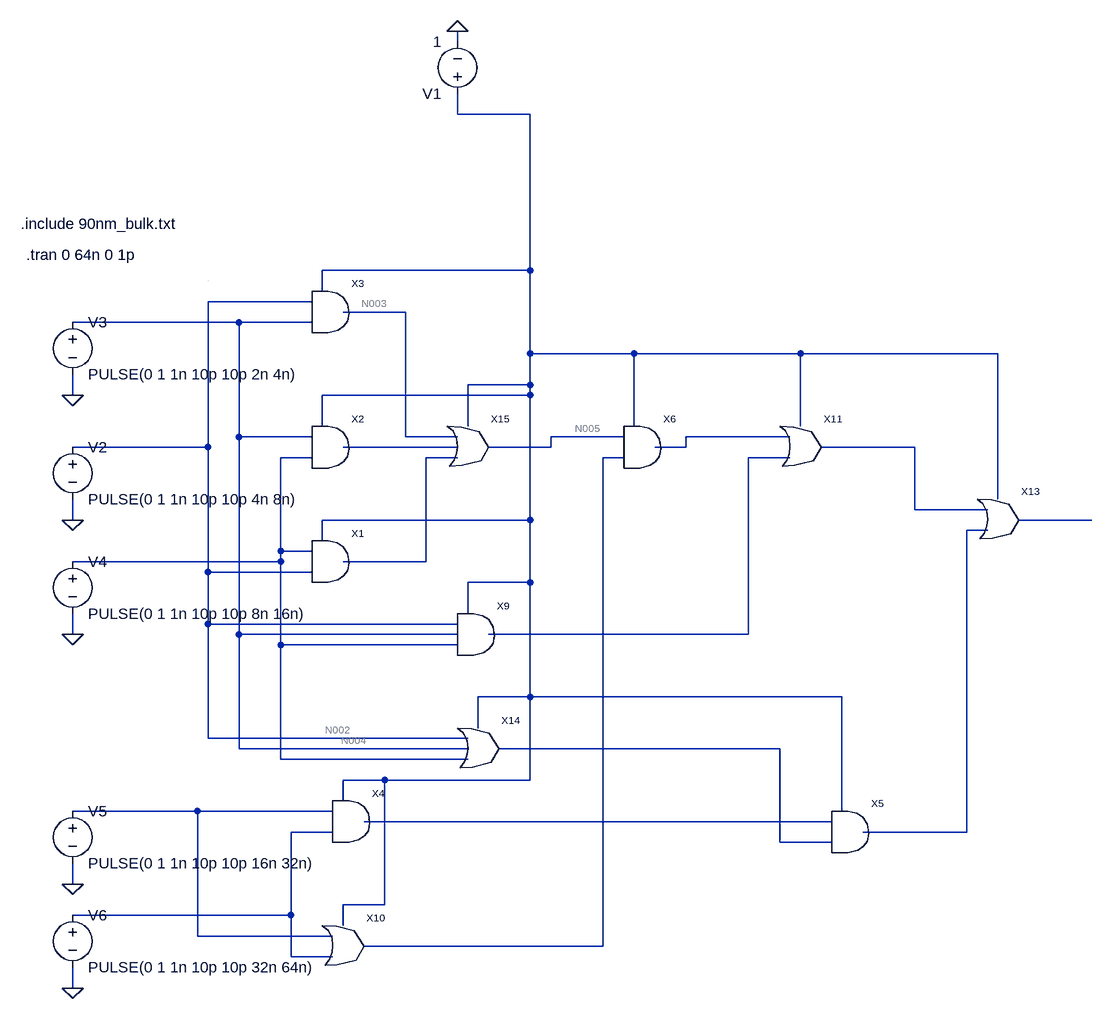
[diagram p0: schematic Major.asc]
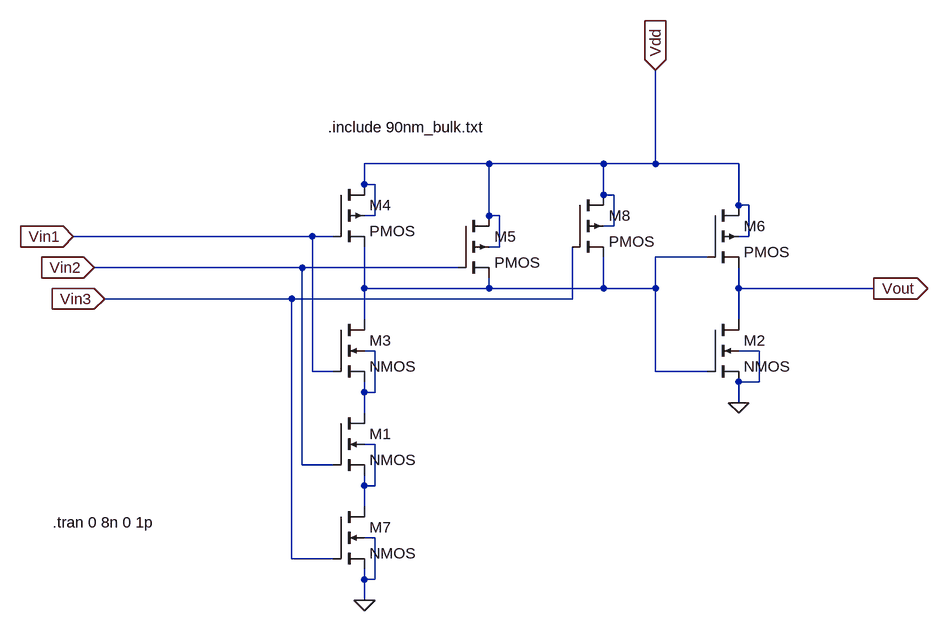
[diagram p1: sub-circuit and3.asc]
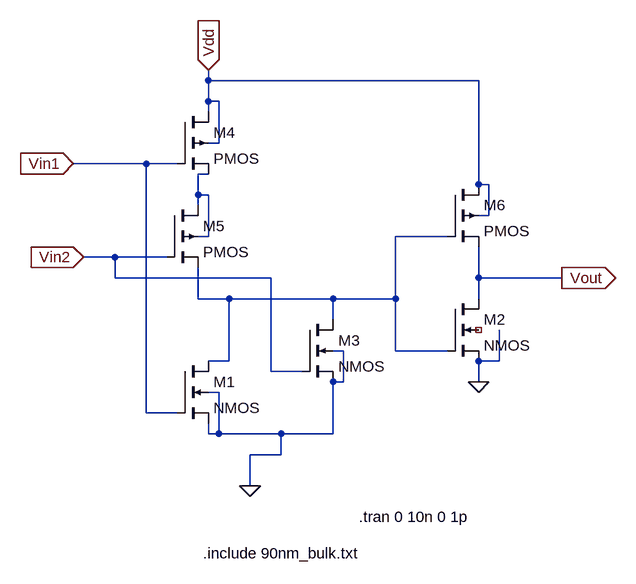
[diagram p2: sub-circuit or.asc]
Major.asc, the LTspice schematic file:
Version 4
SHEET 1 1664 1128
WIRE 384 -368 384 -384
WIRE 384 -256 384 -288
WIRE 496 -256 384 -256
WIRE 496 -16 496 -256
WIRE 496 -16 176 -16
WIRE 176 16 176 -16
WIRE 160 32 0 32
WIRE 304 48 208 48
WIRE 48 64 -208 64
WIRE 160 64 48 64
WIRE 496 112 496 -16
WIRE 656 112 496 112
WIRE 912 112 656 112
WIRE 1216 112 912 112
WIRE 496 160 496 112
WIRE 496 160 400 160
WIRE -208 176 -208 144
WIRE 496 176 496 160
WIRE 496 176 176 176
WIRE 176 224 176 176
WIRE 400 224 400 160
WIRE 656 224 656 112
WIRE 912 224 912 112
WIRE 48 240 48 64
WIRE 160 240 48 240
WIRE 304 240 304 48
WIRE 384 240 304 240
WIRE 640 240 528 240
WIRE 896 240 736 240
WIRE 0 256 0 32
WIRE 0 256 -208 256
WIRE 384 256 208 256
WIRE 528 256 528 240
WIRE 528 256 432 256
WIRE 736 256 736 240
WIRE 736 256 688 256
WIRE 1088 256 944 256
WIRE 160 272 112 272
WIRE 384 272 336 272
WIRE 640 272 608 272
WIRE 896 272 832 272
WIRE 1216 336 1216 112
WIRE 1088 352 1088 256
WIRE 1200 352 1088 352
WIRE -208 368 -208 336
WIRE 496 368 496 176
WIRE 496 368 176 368
WIRE 1360 368 1248 368
WIRE 1200 384 1168 384
WIRE 176 400 176 368
WIRE 112 416 112 272
WIRE 160 416 112 416
WIRE 112 432 112 416
WIRE 112 432 -208 432
WIRE 336 432 336 272
WIRE 336 432 208 432
WIRE 0 448 0 256
WIRE 160 448 0 448
WIRE 496 464 496 368
WIRE 496 464 400 464
WIRE 400 512 400 464
WIRE 0 528 0 448
WIRE 384 528 0 528
WIRE -208 544 -208 512
WIRE 48 544 48 240
WIRE 384 544 48 544
WIRE 832 544 832 272
WIRE 832 544 432 544
WIRE 112 560 112 432
WIRE 384 560 112 560
WIRE 496 640 496 464
WIRE 496 640 416 640
WIRE 976 640 496 640
WIRE 416 688 416 640
WIRE 0 704 0 528
WIRE 400 704 0 704
WIRE 48 720 48 544
WIRE 400 720 48 720
WIRE 880 720 448 720
WIRE 112 736 112 560
WIRE 400 736 112 736
WIRE 272 768 208 768
WIRE 496 768 496 640
WIRE 496 768 272 768
WIRE 208 800 208 768
WIRE -16 816 -208 816
WIRE 192 816 -16 816
WIRE 976 816 976 640
WIRE 960 832 240 832
WIRE 192 848 128 848
WIRE 1168 848 1168 384
WIRE 1168 848 1008 848
WIRE 880 864 880 720
WIRE 960 864 880 864
WIRE -208 928 -208 896
WIRE 272 960 272 768
WIRE 272 960 208 960
WIRE 128 976 128 848
WIRE 128 976 -208 976
WIRE 208 992 208 960
WIRE -16 1008 -16 816
WIRE 192 1008 -16 1008
WIRE 608 1024 608 272
WIRE 608 1024 240 1024
WIRE 128 1040 128 976
WIRE 192 1040 128 1040
WIRE -208 1088 -208 1056
WIRE 0 0 0 0
FLAG 384 -384 0
FLAG -208 176 0
FLAG -208 368 0
FLAG -208 544 0
FLAG -208 928 0
FLAG -208 1088 0
SYMBOL voltage 384 -272 R180
WINDOW 123 0 0 Left 2
WINDOW 39 0 0 Left 2
SYMATTR InstName V1
SYMATTR Value 1
SYMBOL voltage -208 240 R0
WINDOW 123 0 0 Left 2
WINDOW 39 0 0 Left 2
SYMATTR InstName V2
SYMATTR Value PULSE(0 1 1n 10p 10p 4n 8n)
SYMBOL voltage -208 48 R0
WINDOW 123 0 0 Left 2
WINDOW 39 0 0 Left 2
SYMATTR InstName V3
SYMATTR Value PULSE(0 1 1n 10p 10p 2n 4n)
SYMBOL voltage -208 416 R0
WINDOW 123 0 0 Left 2
WINDOW 39 0 0 Left 2
SYMATTR InstName V4
SYMATTR Value PULSE(0 1 1n 10p 10p 8n 16n)
SYMBOL voltage -208 800 R0
WINDOW 123 0 0 Left 2
WINDOW 39 0 0 Left 2
SYMATTR InstName V5
SYMATTR Value PULSE(0 1 1n 10p 10p 16n 32n)
SYMBOL voltage -208 960 R0
WINDOW 123 0 0 Left 2
WINDOW 39 0 0 Left 2
SYMATTR InstName V6
SYMATTR Value PULSE(0 1 1n 10p 10p 32n 64n)
SYMBOL and 192 432 R0
SYMATTR InstName X1
SYMBOL and 192 256 R0
SYMATTR InstName X2
SYMBOL and 192 48 R0
SYMATTR InstName X3
SYMBOL and 224 832 R0
SYMATTR InstName X4
SYMBOL and 992 848 R0
SYMATTR InstName X5
SYMBOL and 672 256 R0
SYMATTR InstName X6
SYMBOL and3 416 544 R0
SYMATTR InstName X9
SYMBOL or 208 1024 R0
SYMATTR InstName X10
SYMBOL or 912 256 R0
SYMATTR InstName X11
SYMBOL or 1216 368 R0
SYMATTR InstName X13
SYMBOL or3 416 720 R0
SYMATTR InstName X14
SYMBOL or3 400 256 R0
SYMATTR InstName X15
TEXT -288 -88 Left 2 !.include 90nm_bulk.txt
TEXT -280 -40 Left 2 !.tran 0 64n 0 1p

and3.asc, the sub-circuit schematic file:
Version 4
SHEET 1 1064 756
WIRE 352 64 160 64
WIRE 528 64 352 64
WIRE 608 64 608 -80
WIRE 608 64 528 64
WIRE 736 64 608 64
WIRE 160 96 160 64
WIRE 176 96 160 96
WIRE 528 112 528 64
WIRE 544 112 528 112
WIRE 736 128 736 64
WIRE 752 128 736 128
WIRE 176 144 176 96
WIRE 176 144 160 144
WIRE 352 144 352 64
WIRE 368 144 352 144
WIRE 544 160 544 112
WIRE 544 160 528 160
WIRE 80 176 -288 176
WIRE 112 176 80 176
WIRE 752 176 752 128
WIRE 752 176 736 176
WIRE 368 192 368 144
WIRE 368 192 352 192
WIRE 688 208 608 208
WIRE 64 224 -256 224
WIRE 304 224 64 224
WIRE 160 256 160 192
WIRE 352 256 352 240
WIRE 352 256 160 256
WIRE 528 256 528 208
WIRE 528 256 352 256
WIRE 608 256 608 208
WIRE 608 256 528 256
WIRE 736 256 736 224
WIRE 944 256 736 256
WIRE 48 272 -240 272
WIRE 480 272 480 192
WIRE 480 272 48 272
WIRE 160 304 160 256
WIRE 736 304 736 256
WIRE 176 352 160 352
WIRE 768 352 736 352
WIRE 80 384 80 176
WIRE 112 384 80 384
WIRE 608 384 608 256
WIRE 688 384 608 384
WIRE 768 400 768 352
WIRE 768 400 736 400
WIRE 160 416 160 400
WIRE 176 416 176 352
WIRE 176 416 160 416
WIRE 736 432 736 400
WIRE 160 448 160 416
WIRE 176 496 160 496
WIRE 64 528 64 224
WIRE 112 528 64 528
WIRE 160 560 160 544
WIRE 176 560 176 496
WIRE 176 560 160 560
WIRE 160 592 160 560
WIRE 176 640 160 640
WIRE 48 672 48 272
WIRE 112 672 48 672
WIRE 160 704 160 688
WIRE 176 704 176 640
WIRE 176 704 160 704
WIRE 160 736 160 704
FLAG -288 176 Vin1
IOPIN -288 176 In
FLAG -256 224 Vin2
IOPIN -256 224 In
FLAG 944 256 Vout
IOPIN 944 256 Out
FLAG 608 -80 Vdd
IOPIN 608 -80 In
FLAG 736 432 0
FLAG -240 272 Vin3
IOPIN -240 272 In
FLAG 160 736 0
SYMBOL nmos4 112 448 R0
SYMATTR InstName M1
SYMATTR Value2 l=90n w=200n
SYMBOL nmos4 688 304 R0
SYMATTR InstName M2
SYMATTR Value2 l=90n w=200n
SYMBOL nmos4 112 304 R0
SYMATTR InstName M3
SYMATTR Value2 l=90n w=200n
SYMBOL pmos4 112 96 R0
SYMATTR InstName M4
SYMATTR Value2 l=90n w=400n
SYMBOL pmos4 304 144 R0
SYMATTR InstName M5
SYMATTR Value2 l=90n w=400n
SYMBOL pmos4 688 128 R0
SYMATTR InstName M6
SYMATTR Value2 l=90n w=400n
SYMBOL nmos4 112 592 R0
SYMATTR InstName M7
SYMATTR Value2 l=90n w=200n
SYMBOL pmos4 480 112 R0
SYMATTR InstName M8
SYMATTR Value2 l=90n w=400n
TEXT 104 8 Left 2 !.include 90nm_bulk.txt
TEXT -320 616 Left 2 !.tran 0 8n 0 1p

or.asc, the sub-circuit schematic file:
Version 4
SHEET 1 968 680
WIRE -160 -464 -160 -480
WIRE 256 -464 -160 -464
WIRE -160 -432 -160 -464
WIRE -144 -432 -160 -432
WIRE -160 -416 -160 -432
WIRE -144 -368 -144 -432
WIRE -144 -368 -160 -368
WIRE -256 -336 -368 -336
WIRE -208 -336 -256 -336
WIRE -160 -320 -176 -320
WIRE 256 -304 256 -464
WIRE 272 -304 256 -304
WIRE -176 -288 -176 -320
WIRE -160 -288 -176 -288
WIRE -176 -272 -176 -288
WIRE 272 -256 272 -304
WIRE 272 -256 256 -256
WIRE -160 -224 -160 -288
WIRE -160 -224 -176 -224
WIRE 208 -224 128 -224
WIRE -304 -192 -352 -192
WIRE -224 -192 -304 -192
WIRE -304 -160 -304 -192
WIRE -64 -160 -304 -160
WIRE 256 -160 256 -208
WIRE 384 -160 256 -160
WIRE -176 -128 -176 -176
WIRE -128 -128 -176 -128
WIRE 32 -128 -128 -128
WIRE 128 -128 128 -224
WIRE 128 -128 32 -128
WIRE 256 -128 256 -160
WIRE 32 -96 32 -128
WIRE 48 -48 32 -48
WIRE 128 -48 128 -128
WIRE 208 -48 128 -48
WIRE -128 -32 -128 -128
WIRE -128 -32 -160 -32
WIRE 288 -32 288 -80
WIRE 288 -32 256 -32
WIRE -64 -16 -64 -160
WIRE -16 -16 -64 -16
WIRE 48 0 48 -48
WIRE 48 0 32 0
WIRE 256 0 256 -32
WIRE -144 16 -160 16
WIRE -256 48 -256 -336
WIRE -208 48 -256 48
WIRE -160 80 -160 64
WIRE -144 80 -144 16
WIRE -144 80 -160 80
WIRE -48 80 -144 80
WIRE 32 80 32 0
WIRE 32 80 -48 80
WIRE -48 112 -48 80
WIRE -48 112 -96 112
WIRE -96 160 -96 112
FLAG -368 -336 Vin1
IOPIN -368 -336 In
FLAG -352 -192 Vin2
IOPIN -352 -192 In
FLAG -96 160 0
FLAG -160 -480 Vdd
IOPIN -160 -480 In
FLAG 256 0 0
FLAG 384 -160 Vout
IOPIN 384 -160 Out
SYMBOL nmos4 -208 -32 R0
SYMATTR InstName M1
SYMATTR Value2 l=90n w=200n
SYMBOL nmos4 -16 -96 R0
SYMATTR InstName M3
SYMATTR Value2 l=90n w=200n
SYMBOL pmos4 -208 -416 R0
SYMATTR InstName M4
SYMATTR Value2 l=90n w=400n
SYMBOL pmos4 -224 -272 R0
SYMATTR InstName M5
SYMATTR Value2 l=90n w=400n
SYMBOL nmos4 208 -128 R0
SYMATTR InstName M2
SYMATTR Value2 l=90n w=200n
SYMBOL pmos4 208 -304 R0
SYMATTR InstName M6
SYMATTR Value2 l=90n w=400n
TEXT -168 264 Left 2 !.include 90nm_bulk.txt
TEXT 72 208 Left 2 !.tran 0 10n 0 1p

The netlist it stands for:
* Major.asc
V1 N001 0 1
V2 N002 0 PULSE(0 1 1n 10p 10p 4n 8n)
V3 N004 0 PULSE(0 1 1n 10p 10p 2n 4n)
V4 N009 0 PULSE(0 1 1n 10p 10p 8n 16n)
V5 N016 0 PULSE(0 1 1n 10p 10p 16n 32n)
V6 N018 0 PULSE(0 1 1n 10p 10p 32n 64n)
XX1 N009 N002 N001 N010 and  ; pins Vin1 Vin2 Vdd Vout
XX2 N004 N009 N001 N007 and  ; pins Vin1 Vin2 Vdd Vout
XX3 N002 N004 N001 N003 and  ; pins Vin1 Vin2 Vdd Vout
XX4 N016 N018 N001 N017 and  ; pins Vin1 Vin2 Vdd Vout
XX5 N017 N015 N001 N014 and  ; pins Vin1 Vin2 Vdd Vout
XX6 N005 N011 N001 N006 and  ; pins Vin1 Vin2 Vdd Vout
XX9 N001 N002 N004 N009 N012 and3
XX10 N016 N018 N001 N011 or
XX11 N006 N012 N001 N008 or
XX13 N008 N014 N001 N013 or
XX14 N002 N009 N001 N015 N004 or3  ; pins Vin1 Vin3 Vdd Vout Vin2
XX15 N003 N010 N001 N005 N007 or3  ; pins Vin1 Vin3 Vdd Vout Vin2

* block symbol definitions
.subckt and3 Vdd Vin1 Vin2 Vin3 Vout
M1 N002 Vin2 N003 N003 NMOS l=90n w=200n
M2 Vout N001 0 0 NMOS l=90n w=200n
M3 N001 Vin1 N002 N002 NMOS l=90n w=200n
M4 Vdd Vin1 N001 Vdd PMOS l=90n w=400n
M5 Vdd Vin2 N001 Vdd PMOS l=90n w=400n
M6 Vdd N001 Vout Vdd PMOS l=90n w=400n
M7 N003 Vin3 0 0 NMOS l=90n w=200n
M8 Vdd Vin3 N001 Vdd PMOS l=90n w=400n
.include 90nm_bulk.txt
.tran 0 8n 0 1p
.ends and3

.subckt or Vin1 Vin2 Vdd Vout
M1 N002 Vin1 0 0 NMOS l=90n w=200n
M3 N002 Vin2 0 0 NMOS l=90n w=200n
M4 Vdd Vin1 N001 Vdd PMOS l=90n w=400n
M5 N001 Vin2 N002 N001 PMOS l=90n w=400n
M2 Vout N002 0 NC_01 NMOS l=90n w=200n
M6 Vdd N002 Vout Vdd PMOS l=90n w=400n
.include 90nm_bulk.txt
.tran 0 10n 0 1p
.ends or

.model NMOS NMOS
.model PMOS PMOS
.lib standard.mos
.include 90nm_bulk.txt
.tran 0 64n 0 1p
.backanno
.end

* Results of the author's LTspice run, read from the files saved beside the schematic
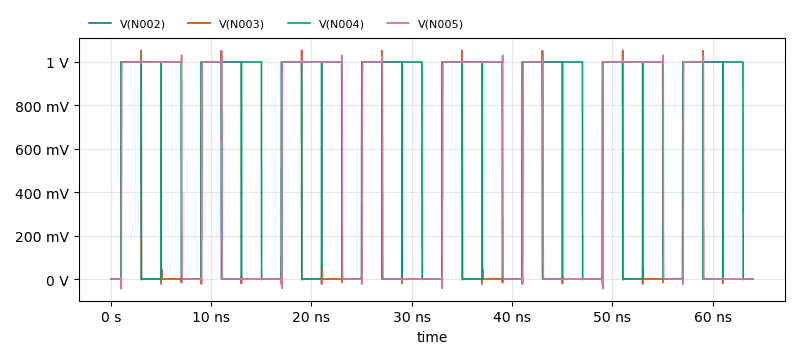
[diagram p3: Transient Analysis of Major.asc, plotted from the saved traces]
* Transient Analysis, 1 run:
*   V(N002): min 0 V, max 1 V, average 501.2 mV, rms 707.7 mV, last 0 V
*   V(N003): min -24.77 mV, max 1.054 V, average 250.4 mV, rms 499.4 mV, last 11.54 µV
*   V(N004): min 0 V, max 1 V, average 502.5 mV, rms 708.3 mV, last 0 V
*   V(N005): min -45.04 mV, max 1.032 V, average 503.1 mV, rms 708.5 mV, last 10.75 µV